# Altium schematic sheet 主机.SchDoc
size A4
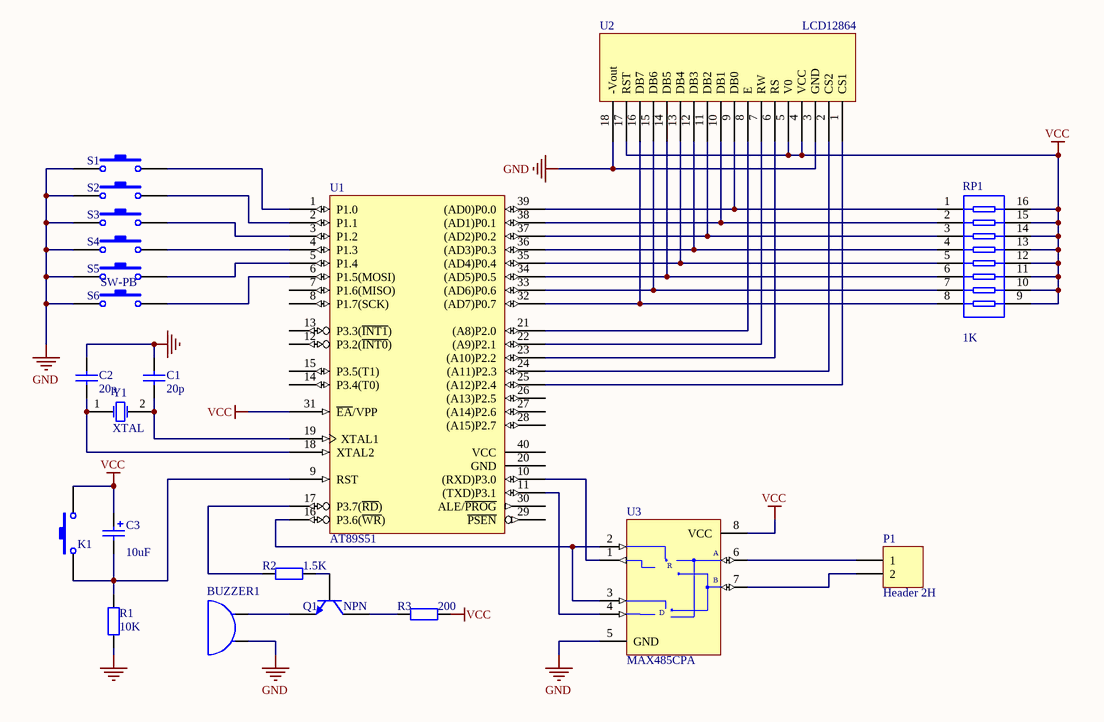
[diagram p0: 主机.SchDoc]

## Parts
BUZZER1  BUZZER  [SP/10/14]  (value not drawn)
C1  value 20p  [RAD-0.3]  (hidden comment: Cap)
C2  value 20p  [RAD-0.3]  (hidden comment: Cap)
C3  value 10uF  [POLAR0.8]  (hidden comment: Cap Pol2)
K1  SW-PB  [SPST-2]  (value not drawn)
P1  Header 2H  [HDR1X2H]
Q1  NPN  [TO-226]
R1  10K  [AXIAL-0.3]
R2  value 1.5K  [AXIAL-0.3]  (hidden comment: 10K)
R3  value 200  [AXIAL-0.3]  (hidden comment: 10K)
RP1  value 1K  [SSOP16]  (hidden comment: Res Pack4)
S1  SW-PB  [SPST-2]  (value not drawn)
S2  SW-PB  [SPST-2]  (value not drawn)
S3  SW-PB  [SPST-2]  (value not drawn)
S4  SW-PB  [SPST-2]  (value not drawn)
S5  SW-PB  [SPST-2]
S6  SW-PB  [SPST-2]  (value not drawn)
U1  AT89S51  [DIP-40]
U2  LCD12864  [SIL-20]
U3  MAX485CPA  [PA8]
Y1  XTAL  [R38]

## Nets
GND: BUZZER1.1 C1.1 C2.1 R1.2 S1.1 S2.1 S3.1 S4.1 S5.1 S6.1 U2.3(GND) U2.18(-Vout) U3.5(GND)
VCC: C3.1 K1.2 R3.2 RP1.9 RP1.10 RP1.11 RP1.12 RP1.13 RP1.14 RP1.15 RP1.16 U1.31(~{EA}/VPP) U2.4(VCC) U2.5(V0) U2.17(RST) U3.8(VCC)
NetBUZZER1_2: BUZZER1.2 Q1.3(E)
NetC1_2: C1.2 U1.19(XTAL1) Y1.2(OSC2)
NetC2_2: C2.2 U1.18(XTAL2) Y1.1(OSC1)
NetC3_2: C3.2 K1.1 R1.1 U1.9(RST)
NetP1_1: P1.1 U3.6(A)
NetP1_2: P1.2 U3.7(B)
NetQ1_1: Q1.1(C) R3.1
NetQ1_2: Q1.2(B) R2.2
NetR2_1: R2.1 U1.17(P3.7(~{RD}))
NetRP1_1: RP1.1 U1.39((AD0)P0.0) U2.9(DB0)
NetRP1_2: RP1.2 U1.38((AD1)P0.1) U2.10(DB1)
NetRP1_3: RP1.3 U1.37((AD2)P0.2) U2.11(DB2)
NetRP1_4: RP1.4 U1.36((AD3)P0.3) U2.12(DB3)
NetRP1_5: RP1.5 U1.35((AD4)P0.4) U2.13(DB4)
NetRP1_6: RP1.6 U1.34((AD5)P0.5) U2.14(DB5)
NetRP1_7: RP1.7 U1.33((AD6)P0.6) U2.15(DB6)
NetRP1_8: RP1.8 U1.32((AD7)P0.7) U2.16(DB7)
NetS1_2: S1.2 U1.1(P1.0)
NetS2_2: S2.2 U1.2(P1.1)
NetS3_2: S3.2 U1.3(P1.2)
NetS4_2: S4.2 U1.4(P1.3)
NetS5_2: S5.2 U1.5(P1.4)
NetS6_2: S6.2 U1.6(P1.5(MOSI))
NetU1_10: U1.10((RXD)P3.0) U3.1(RO)
NetU1_11: U1.11((TXD)P3.1) U3.4(DI)
NetU1_16: U1.16(P3.6(~{WR})) U3.2(~{RE}) U3.3(DE)
NetU1_21: U1.21((A8)P2.0) U2.8(E)
NetU1_22: U1.22((A9)P2.1) U2.7(RW)
NetU1_23: U1.23((A10)P2.2) U2.6(RS)
NetU1_24: U1.24((A11)P2.3) U2.2(CS2)
NetU1_25: U1.25((A12)P2.4) U2.1(CS1)

Not connected (* = marked no-connect by the designer): U1 7(P1.6(MISO)) 8(P1.7(SCK)) 12(P3.2(~{INT0})) 13(P3.3(~{INT1})) 14(P3.4(T0)) 15(P3.5(T1)) 20(GND) 26((A13)P2.5) 27((A14)P2.6) 28((A15)P2.7) 29(~{PSEN}) 30(ALE/~{PROG}) 40(VCC)

## Notes on the sheet
- (in symbol MAX485CPA) R; D

## Library data of the parts
C1 C2 = Cap: Capacitor; Published: 8-Jun-2000; LatestRevisionDate: 17-Jul-2002; LatestRevisionNote: Re-released for DXP Platform.; PackageReference: RAD-0.3; Publisher: Altium Limited
C3 = Cap Pol2: Polarized Capacitor (Axial); Published: 8-Jun-2000; LatestRevisionDate: 17-Jul-2002; LatestRevisionNote: Re-released for DXP Platform.; PackageReference: POLAR0.8; Publisher: Altium Limited
K1 S1-S6 = SW-PB: Switch; Published: 24-Mar-1999; LatestRevisionDate: 17-Jul-2002; LatestRevisionNote: Re-released for DXP Platform.; PackageReference: SPST-2; Publisher: Altium Limited
P1 = Header 2H: Header, 2-Pin, Right Angle; LatestRevisionDate: 17-Jul-2002; LatestRevisionNote: Re-released for DXP Platform.; Publisher: Altium Limited
Q1 = NPN: NPN Bipolar Transistor; Published: 8-Jun-2000; LatestRevisionDate: 17-Jul-2002; LatestRevisionNote: Re-released for DXP Platform.; PackageReference: TO-226; Publisher: Altium Limited; Code_JEDEC: TO-226-AA
R1-R3 = Res2: Resistor; Published: 8-Jun-2000; LatestRevisionDate: 17-Jul-2002; LatestRevisionNote: Re-released for DXP Platform.; PackageReference: AXIAL-0.4; Publisher: Altium Limited
  R1: Value: 10K
RP1 = Res Pack4: Isolated Resistor Network; Published: 24-Mar-1999; LatestRevisionDate: 17-Jul-2002; LatestRevisionNote: Re-released for DXP Platform.; PackageReference: SSOP16; Publisher: Altium Limited; Code_JEDEC: MO-150-AC
U1 = AT89S51: 8-Bit Microcontroller with 4K ISP Flash ROM
U3 = MAX485CPA: Low-Power, Slew-Rate-Limited RS-485/RS-422 Transceiver; Published: 16-Jan-2001; LatestRevisionDate: 06-Jun-2005; LatestRevisionNote: Stylized 3D Model Added.; DatasheetVersion: Feb-1996; PackageVersion: RevB, 21-0043; PackageReference: PA8; Publisher: Altium Limited; PackageDescription: DIP; 8 Leads; Row Spacing 7.62 mm; Pitch 2.54 mm; Code_JEDEC: MS-001-AB; ComponentLink1Description: Manufacturer Link; ComponentLink1URL: http://www.maxim-ic.com/; ComponentLink2Description: Datasheet; ComponentLink2URL: http://pdfserv.maxim-ic.com/en/ds/MAX1487-MAX491.pdf
Y1 = XTAL: Crystal Oscillator; Published: 8-Jun-2000; LatestRevisionDate: 17-Jul-2002; LatestRevisionNote: Re-released for DXP Platform.; PackageReference: R38; Publisher: Altium Limited